# EasyEDA Pro project 实战项目.eprj, board PCB1
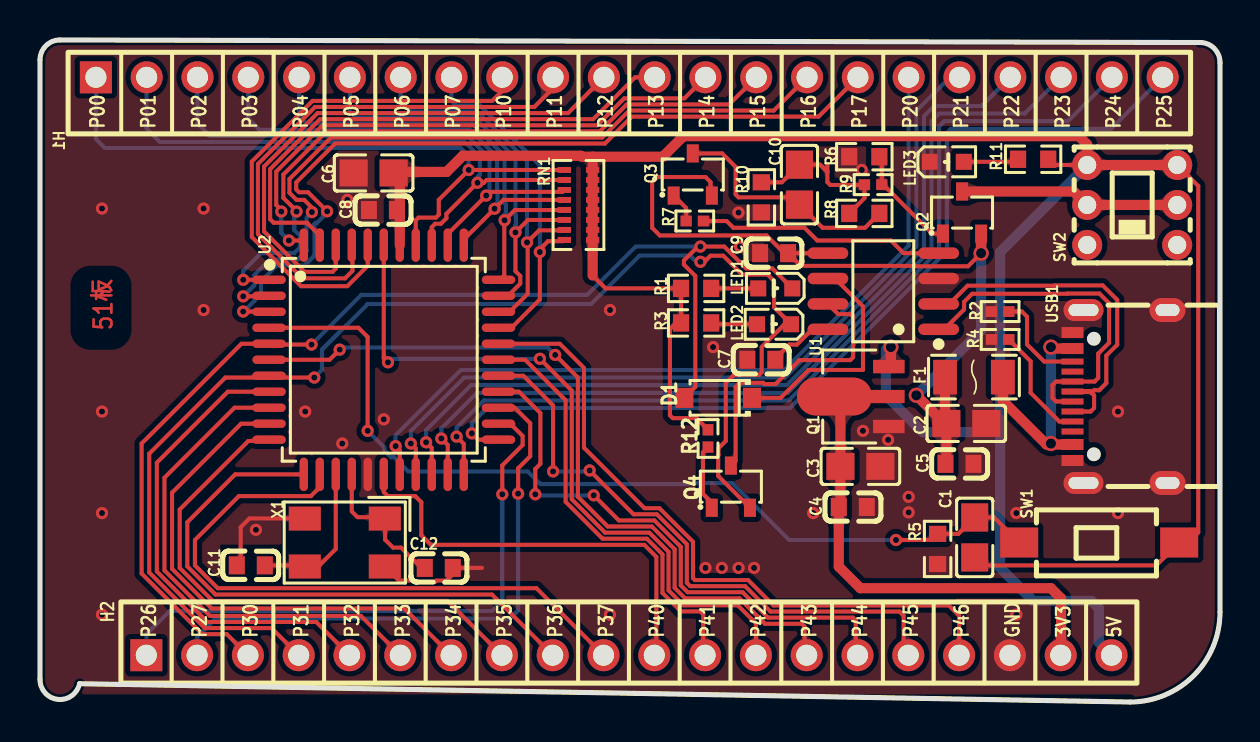
[diagram p1: board, top side]
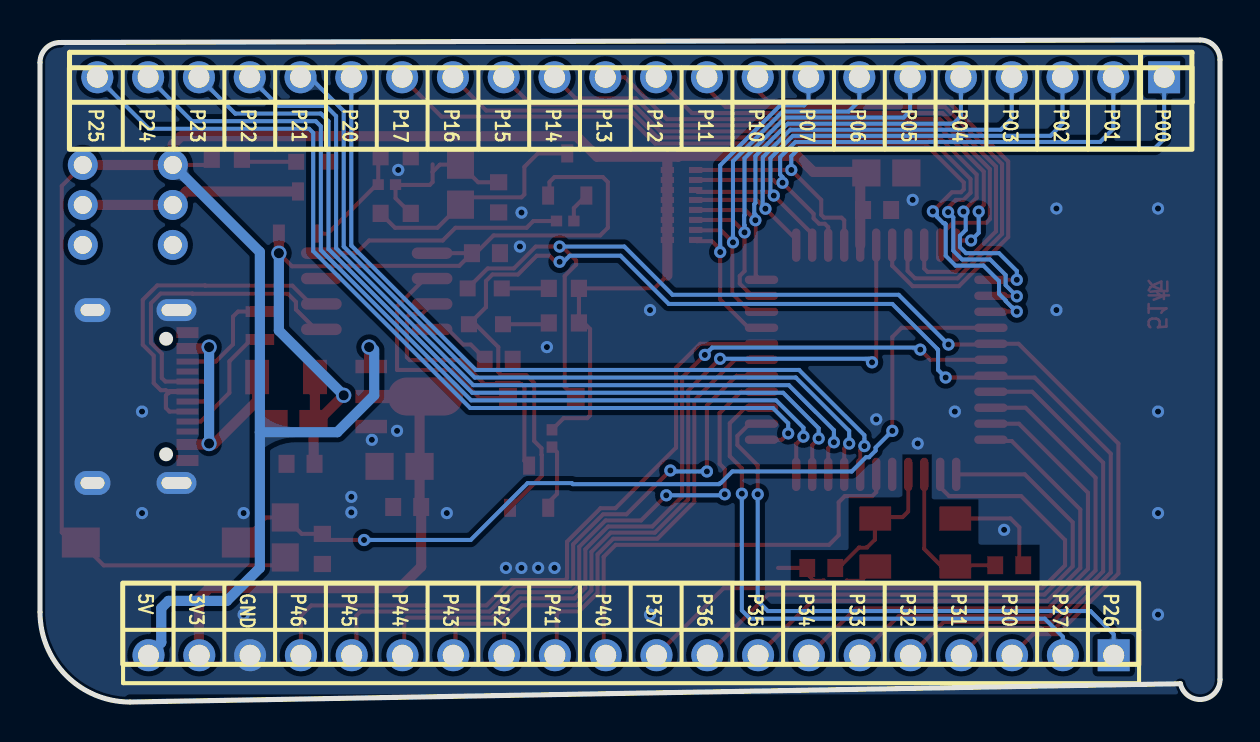
[diagram p2: board, bottom side, seen from below]

Outline 59 x 33.13 mm; copper layers: Top Layer, Bottom Layer. Coordinates in mm from the lower left corner of the outline.
Outline path: 0,32.13 0,1.13 arc(0.89,0.13) 1.98,0.92 54.5,0 arc(57.68,1.32) 59,4.5 59,32 arc(58.71,32.71) 58,33 1,33.13 arc(0.29,32.83) 0,32.13
Stack: Top Layer 0.035mm / Dielectric1 1.51mm FR4 er 4.5 / Bottom Layer 0.035mm

## Design rules (mm)
net USB_D+: DP1
net USB_D-: DP1
template: 自定义配置
spacing copperThickness1oz (default): track to track 0.102, other pairs 0.152 to 0.3
spacing copperThickness2oz: track to track 0.203, other pairs 0.152 to 0.3
track width copperThickness1oz (default): min 0.127, default 0.254, max 2.54
track width copperThickness2oz: min 0.203, default 0.254, max 2.54
differential pair differentialPair (default): width min 0.127, default 0.254, max 2.54; gap min 0.152, default 0.152
via viaSize (default): diameter min 0.5, default 0.61, max 10; hole min 0.3, default 0.305, max 6.3

## Placement (name value [footprint] x y rotation side)
C1  10uF  [C0805]  46.74 8.23 270 top
C2  10uF  [C0805]  46.32 13.94 180 top
C3  10uF  [C0805]  41.02 11.79 180 top
C4  100nF  [C0603]  40.64 9.76 180 top
C5  100nF  [C0603]  45.97 11.92 180 top
C6  10uF  [C0805]  16.68 26.47 180 top
C7  100nF  [C0603]  36.07 17.12 0 top
C8  100nF  [C0603]  17.15 24.62 180 top
C9  100nF  [C0603]  36.7 22.46 0 top
C10  22uF  [C0805]  37.97 25.89 90 top
C11  20pF  [C0603]  10.54 6.84 0 top
C12  20pF  [C0603]  19.94 6.71 180 top
D1  B0520W  [SOD-123_L2.6-W1.7-LS3.5-RD]  33.91 15.22 180 top
F1  JK-nSMD050-30  [F1206]  46.7 16.26 180 top
H1  X6511WV-22H-C60D30  [HDR-TH_22P-P2.54-V-M]  29.46 31.26 0 bottom
H2  X6511WV-20H-C60D30  [HDR-TH_20P-P2.54-V-M]  29.45 2.34 0 bottom
LED1  SZYY0603R  [LED0603-R-RD]  36.76 20.7 180 top
LED2  SZYY0603R  [LED0603-R-RD]  36.7 18.9 180 top
LED3  SZYY0603R  [LED0603-R-RD]  45.34 27.03 0 top
Q1  AMS1117-3.3V  [SOT-89-3_L4.5-W2.5-P1.50-LS4.2-BR]  41.08 15.29 0 top
Q2  AO3401  [SOT-23-3_L2.9-W1.4-P1.90-LS2.6-BR]  46.1 24.49 270 top
Q3  AO3401  [SOT-23-3_L2.9-W1.4-P1.90-LS2.6-BR]  32.64 26.4 270 top
Q4  2SK3018  [SOT-23-3_L2.9-W1.4-P1.90-LS2.6-BR]  34.54 10.77 270 top
R1  1kΩ  [R0603]  32.81 20.7 180 top
R2  5.1kΩ  [R0402]  48.01 19.54 180 top
R3  1kΩ  [R0603]  32.81 18.97 180 top
R4  5.1kΩ  [R0402]  48.01 18.14 180 top
R5  10kΩ  [R0603]  44.88 7.66 90 top
R6  10kΩ  [R0603]  41.22 27.28 0 top
R7  10Ω  [R0402]  32.74 24.07 180 top
R8  47kΩ  [R0603]  41.22 24.45 0 top
R9  10Ω  [R0402]  41.66 25.89 180 top
R10  10kΩ  [R0603]  36.07 25.25 90 top
R11  1kΩ  [R0603]  49.66 27.16 0 top
R12  10Ω  [R0402]  33.4 13.19 90 top
RN1  10kΩ  [RES-ARRAY-SMD_0402-16P-L4.0-W1.6-BL]  26.92 24.87 270 top
SW1  TS-1101-C-W  [SW-SMD_L6.0-W3.3-LS8.0]  52.96 7.98 0 top
SW2  PS-5850A-6PL  [SW-TH_6P-L5.8-W5.8-P2.00-LS4.5-BL_1]  54.61 24.87 90 top
U1  CH340N  [SOP-8_L5.0-W4.0-P1.27-LS6.0-BL]  42.16 20.55 90 top
U2  STC89C52RC-40I-LQFP44  [LQFP-44_L10.0-W10.0-P0.80-LS12.0-BL]  17.19 17.13 270 top
USB1  TYPE-C 16PIN 2MD(073)  [USB-C-SMD_TYPE-C-6PIN-2MD-073]  54 15.29 90 top
X1  11.0592MHz  [CRYSTAL-SMD_4P-L5.0-W3.2-BL]  15.24 7.98 180 top

## Footprints (pads in the part's own frame, mm; a bottom-side part is the same pattern mirrored in y, then rotated)
C0603
  rect 0.8x0.9 smd: 1(-0.7,0) 2(0.7,0)
C0805
  rect 1.41x1.35 smd: 1(-1,0) 2(1,0)
CRYSTAL-SMD_4P-L5.0-W3.2-BL
  rect 1.6x1.2 smd: 1(-2,-1.2) 2(2,-1.2) 3(2,1.2) 4(-2,1.2)
F1206
  rect 1.19x1.728 smd: 1(-1.445,0) 2(1.445,0)
HDR-TH_20P-P2.54-V-M
  rect 1.6x1.6 hole 1.05: 1(-24.13,0)
  round 1.6 hole 1.05: 2(-21.59,0) 3(-19.05,0) 4(-16.51,0) 5(-13.97,0) 6(-11.43,0) 7(-8.89,0) 8(-6.35,0) 9(-3.81,0) 10(-1.27,0) 11(1.27,0) 12(3.81,0) 13(6.35,0) 14(8.89,0) 15(11.43,0) 16(13.97,0) 17(16.51,0) 18(19.05,0) 19(21.59,0) 20(24.13,0)
HDR-TH_22P-P2.54-V-M
  rect 1.6x1.6 hole 1.05: 1(-26.67,0)
  round 1.6 hole 1.05: 2(-24.13,0) 3(-21.59,0) 4(-19.05,0) 5(-16.51,0) 6(-13.97,0) 7(-11.43,0) 8(-8.89,0) 9(-6.35,0) 10(-3.81,0) 11(-1.27,0) 12(1.27,0) 13(3.81,0) 14(6.35,0) 15(8.89,0) 16(11.43,0) 17(13.97,0) 18(16.51,0) 19(19.05,0) 20(21.59,0) 21(24.13,0) 22(26.67,0)
LED0603-R-RD
  rect 0.8x0.8 smd: 1(0.851,0) 2(-0.851,0)
LQFP-44_L10.0-W10.0-P0.80-LS12.0-BL
  oval 0.42x1.67 smd: 1(-4,-5.735) 2(-3.2,-5.735) 3(-2.4,-5.735) 4(-1.6,-5.735) 5(-0.8,-5.735) 6(0,-5.735) 7(0.8,-5.735) 8(1.6,-5.735) 9(2.4,-5.735) 10(3.2,-5.735) 11(4,-5.735) 23(4,5.735) 24(3.2,5.735) 25(2.4,5.735) 26(1.6,5.735) 27(0.8,5.735) 28(0,5.735) 29(-0.8,5.735) 30(-1.6,5.735) 31(-2.4,5.735) 32(-3.2,5.735) 33(-4,5.735)
  oval 1.67x0.42 smd: 12(5.735,-4) 13(5.735,-3.2) 14(5.735,-2.4) 15(5.735,-1.6) 16(5.735,-0.8) 17(5.735,0) 18(5.735,0.8) 19(5.735,1.6) 20(5.735,2.4) 21(5.735,3.2) 22(5.735,4) 34(-5.735,4) 35(-5.735,3.2) 36(-5.735,2.4) 37(-5.735,1.6) 38(-5.735,0.8) 39(-5.735,0) 40(-5.735,-0.8) 41(-5.735,-1.6) 42(-5.735,-2.4) 43(-5.735,-3.2) 44(-5.735,-4)
R0402
  rect 0.566x0.54 smd: 1(-0.433,0) 2(0.433,0)
R0603
  rect 0.806x0.864 smd: 1(-0.753,0) 2(0.753,0)
RES-ARRAY-SMD_0402-16P-L4.0-W1.6-BL
  rect 0.3x0.665 smd: 1(-1.75,-0.708) 2(-1.25,-0.708) 3(-0.75,-0.708) 4(-0.25,-0.708) 5(0.25,-0.708) 6(0.75,-0.708) 7(1.25,-0.708) 8(1.75,-0.708) 9(1.75,0.708) 10(1.25,0.708) 11(0.75,0.708) 12(0.25,0.708) 13(-0.25,0.708) 14(-0.75,0.708) 15(-1.25,0.708) 16(-1.75,0.708)
SOD-123_L2.6-W1.7-LS3.5-RD
  rect 0.9x1 smd: 1(-1.692,0) 2(1.692,0)
SOP-8_L5.0-W4.0-P1.27-LS6.0-BL
  oval 0.574x2.035 smd: 1(-1.905,-2.768) 2(-0.635,-2.768) 3(0.635,-2.768) 4(1.905,-2.768) 5(1.905,2.768) 6(0.635,2.768) 7(-0.635,2.768) 8(-1.905,2.768)
SOT-23-3_L2.9-W1.4-P1.90-LS2.6-BR
  rect 0.91x0.6 smd: 1(1.055,-0.955) 2(1.055,0.955) 3(-1.055,0)
SOT-89-3_L4.5-W2.5-P1.50-LS4.2-BR
  rect 1.575x0.672 smd: 1(1.356,-1.5) 3(1.356,1.5)
  custom 5.377x1.9 smd: 2(-1.356,0)
SW-SMD_L6.0-W3.3-LS8.0
  rect 1.9x1.5 smd: 1(-4,0) 2(4,0)
SW-TH_6P-L5.8-W5.8-P2.00-LS4.5-BL_1
  round 1.5 hole 0.9: 1(-2,-2.25) 2(0,-2.25) 3(2,-2.25) 4(-2,2.25) 5(0,2.25) 6(2,2.25)
USB-C-SMD_TYPE-C-6PIN-2MD-073
  rect 0.55x1.1 smd: 1(-3.2,2.375) 2(-2.4,2.375) 11(2.4,2.375) 12(3.2,2.375)
  rect 0.3x1.1 smd: 3(-1.75,2.375) 4(-1.25,2.375) 5(-0.75,2.375) 6(-0.25,2.375) 7(0.25,2.375) 8(0.75,2.375) 9(1.25,2.375) 10(1.75,2.375)
  oval 1.1x2 hole 0.6x1.5: 13(-4.325,1.825) 14(4.325,1.825)
  oval 1.2x1.8 hole 0.6x1.2: 13(-4.325,-2.375) 14(4.325,-2.375)

## Nets
As in the schematic.

Pads without a net: SW2 1 4; USB1 3 9

## Via types
v1: diameter 0.762, hole 0.508, Top Layer to Bottom Layer, 5 vias
v2: diameter 0.61, hole 0.305, Top Layer to Bottom Layer, 68 vias

## Routing (per net, layer and track width the routed paths; a pad name or vN(x,y) marks a point on that pad's centre or on a via; arc(x,y) is an arc through that point)
3V3: length 23.4
  Top Layer w0.508: Q1.2 40.02,14.99 C3.2 40.02,9.84 C4.2 39.94,6.78 41.02,5.69 50.55,5.69 51.05,5.19 51.05,2.23 51.04,2.21
GND: length 11
  Top Layer w0.203: C11.1 10.03,7.03 10.03,8.74 10.48,9.19 13.23,9.19 X1.2 ; X1.4 17.94,6.08 18.67,6.08 18.73,6.01 19.74,6.01 19.81,6.08 20.32,6.08 20.64,6.39 20.64,6.71 22.1,6.71
  vias: v2(3.1,24.69) v2(3.1,14.53) v2(3.1,9.45) v2(3.1,4.37) v2(8.18,24.69) v2(8.18,19.61) v2(10.79,8.62) v2(13.26,14.53) v2(15.11,12.93) v2(15.37,25.13) v2(17.19,14.14) v2(28.5,19.61) v2(28.5,4.37) v2(33.27,6.71) v2(33.66,17.76) v2(34.09,6.71) v2(34.93,24.49) v2(34.93,6.71) v2(35,22.79) v2(35.7,6.71) v2(38.66,9.45) v2(41.09,26.62) v2(41.15,13.57) v2(42.41,13.12) v2(43.43,10.27) v2(43.43,9.49) v2(48.82,9.45) v2(48.82,4.37) v2(53.9,14.53) v2(53.9,9.45)
VCC: length 137.1
  Top Layer w0.203: 27.63,21.34 28.28,20.7 R1.2 R3.2 31.8,18.97 31.5,18.67 31.5,14.35 31.64,14.2 32.82,14.2 R12.2 ; SW2.6 50.7,26.87 R11.2 ; C1.2 47.13,6.84 55.82,6.84 SW1.2 57.4,7.98 57.91,8.49 57.91,25.82 SW2.3
  Top Layer w0.508: 27.63,27.28 31.14,27.28 32.17,28.31 51.94,28.31 52.36,27.89 SW2.6 SW2.3 ; 27.63,27.28 RN1.16 RN1.15 RN1.14 RN1.13 RN1.12 RN1.11 RN1.10 RN1.9 27.63,21.34 ; 27.63,27.28 27.09,27.28 27.05,27.33 21.14,27.33 20.33,26.52 17.99,26.52 U2.38 ; Q1.3 42.54,16.89 v1(42.54,17.76)
  Bottom Layer w0.508: 48.01,13.5 44.14,13.5 42.29,15.35 42.29,17.63 ; 48.01,13.5 48.01,22.52 SW2.6 ; 48.01,13.5 48.01,6.71 49.66,5.06 52.58,5.06 52.94,4.7 52.94,2.98 H2.20
VCC_SW: length 11
  Top Layer w0.508: SW2.2 SW2.5 51.69,25.55 Q2.3
VIN_5V: length 41.4
  Top Layer w0.203: C9.2 38.04,21.82 43.73,21.82 43.75,21.8 46.4,21.8 v1(47.06,22.46) ; C9.2 U1.5 ; C9.2 37.21,22.46 36.32,23.35 30.99,23.35 30.61,23.73 30.61,26.02 30.86,26.27 33.27,26.27 33.53,26.02 33.53,25.41 Q3.2
  Top Layer w0.508: v1(43.81,15.35) 45.22,13.94 C2.2 45.32,11.96 ; Q2.2 v1(47.06,22.46) ; F1.2 45.25,14.01
  Bottom Layer w0.508: v1(43.81,15.35) 47.06,18.59 v1(47.06,22.46)
P00: length 32.9
  Top Layer w0.203: RN1.1 v2(21.44,26.62) 19.94,25.13 19.94,24.38 19.8,24.24 18.92,24.24 18.79,24.1 U2.37
  Bottom Layer w0.203: v2(21.44,26.62) 21.44,27.31 21.03,27.72 3.25,27.72 2.79,28.17 H1.1
P01: length 29.8
  Top Layer w0.203: RN1.2 22.33,26.12 22.19,25.98 v2(21.87,25.98) 20.32,24.43 20.32,24.2 20.05,23.93 19.76,23.93 19.59,23.76 U2.36
  Bottom Layer w0.203: H1.2 5.33,28.68 5.99,28.02 21.23,28.02 21.99,27.26 21.99,26.39 21.87,26.27 v2(21.87,25.98)
P02: length 26.9
  Top Layer w0.203: RN1.3 26.12,25.53 22.49,25.53 v2(22.31,25.34) 20.39,23.42 U2.35
  Bottom Layer w0.203: v2(22.31,25.34) 22.48,25.51 22.48,27.21 21.36,28.33 8.48,28.33 7.87,28.94 H1.3
P03: length 24.1
  Top Layer w0.203: RN1.4 26.21,25.13 23.17,25.13 v2(22.73,24.68) 21.19,23.14 U2.34
  Bottom Layer w0.203: H1.4 10.41,29.19 10.97,28.64 21.48,28.64 22.86,27.26 22.86,25.58 22.87,25.57 22.87,24.82 v2(22.73,24.68)
P04: length 22.6
  Top Layer w0.203: 22.99,21.13 23.21,21.35 23.21,24.09 v2(23.23,24.11) 23.74,24.62 26.21,24.62 RN1.5
  Bottom Layer w0.203: v2(23.23,24.11) 23.23,24.39 23.29,24.45 23.29,24.91 23.23,24.97 23.23,27.32 21.61,28.94 13.33,28.94 12.95,29.32 H1.5
P05: length 21.4
  Top Layer w0.203: RN1.6 24.4,24.12 v2(23.77,23.5) 23.77,21.56 24.01,21.32 24.01,20.93 23.4,20.33 U2.32
  Bottom Layer w0.203: H1.6 15.49,29.57 15.82,29.25 21.74,29.25 23.77,27.21 23.77,24.36 23.79,24.34 23.79,23.88 23.77,23.86 v2(23.77,23.5)
P06: length 19.4
  Top Layer w0.203: U2.31 23.48,19.53 24.38,20.43 24.38,22.97 v2(24.35,23) 24.95,23.6 26.2,23.6 RN1.7
  Bottom Layer w0.203: v2(24.35,23) 24.35,27.06 21.86,29.55 18.56,29.55 18.03,30.08 H1.7
P07: length 17.9
  Top Layer w0.203: U2.30 23.57,18.73 24.99,20.14 v2(24.99,22.52) 24.99,22.65 25.4,23.06 26.15,23.06 RN1.8
  Bottom Layer w0.203: v2(24.99,22.52) 24.99,26.86 21.99,29.86 20.8,29.86 20.57,30.08 H1.8
P10: length 26.7
  Top Layer w0.203: H1.9 23.11,30.59 22.61,30.08 13.62,30.08 10.59,27.05 10.59,23.27 13.05,20.81 15.37,20.81 16.39,21.83 U2.40
P11: length 27.5
  Top Layer w0.203: U2.41 15.62,22.83 15.62,21.57 15.25,21.2 13.12,21.2 10.9,23.42 10.9,26.92 13.75,29.77 24.71,29.77 25.65,30.71 H1.10
P12: length 27.8
  Top Layer w0.203: H1.11 26.4,29.47 13.88,29.47 11.2,26.79 11.2,23.55 13.23,21.52 14.62,21.52 14.79,21.69 U2.42
P13: length 26.9
  Top Layer w0.203: H1.12 29.76,31.26 27.66,29.16 14,29.16 11.51,26.67 11.51,24.16 11.68,23.98 13.34,23.98 13.37,23.95 13.38,23.95 13.99,23.34 U2.43
P14: length 27.7
  Top Layer w0.203: U2.44 12.96,23.09 12.7,23.09 ; H1.13 32.22,30.21 29.21,30.21 27.86,28.86 14.13,28.86 11.81,26.54 11.81,24.87 12.06,24.62 v2(12.06,24.54)
  Bottom Layer w0.203: v2(12.45,23.09) 12.06,23.48 v2(12.06,24.54)
P15: length 34.8
  Top Layer w0.203: v2(12.83,24.54) 12.83,24.57 12.17,25.23 12.17,26.39 14.33,28.55 27.99,28.55 29.34,29.9 34.46,29.9 H1.14 ; U2.1 v2(10.16,21.13)
  Bottom Layer w0.203: v2(10.16,21.13) 10.16,21.57 11.05,22.46 12.7,22.46 13,22.76 13,23.33 12.71,23.62 12.71,24.43 v2(12.83,24.54)
P16: length 38.1
  Top Layer w0.203: v2(13.59,24.51) 13.59,24.74 13.21,25.13 12.83,25.13 12.47,25.48 12.47,26.17 14.55,28.25 28.12,28.25 29.46,29.6 36.69,29.6 H1.15 ; U2.2 11.43,20.3 v2(10.16,20.3)
  Bottom Layer w0.203: v2(13.59,24.51) 13.34,24.25 13.34,22.59 12.89,22.14 11.49,22.14 10.72,21.37 10.72,20.86 v2(10.16,20.3)
P17: length 41.3
  Top Layer w0.203: v2(14.36,24.55) 13.4,25.51 12.95,25.51 12.81,25.65 12.81,26 14.75,27.94 28.24,27.94 29.59,29.29 38.93,29.29 H1.16 ; U2.3 11.44,19.54 10.41,19.54
  Bottom Layer w0.203: v2(14.36,24.55) 14.15,24.35 14.15,24.28 13.83,23.95 13.76,23.95 13.72,23.91 13.72,22.33 13.22,21.84 11.82,21.84 11.05,21.06 11.05,20.43 10.72,20.1 10.72,20.07 10.39,19.74 10.36,19.74 v2(10.16,19.54)
P20: length 40
  Top Layer w0.203: U2.18 17.99,12.6 v2(17.78,12.81)
  Bottom Layer w0.203: H1.17 43.43,22.84 37.21,16.62 21.05,16.62 17.78,13.35 v2(17.78,12.81)
P21: length 41
  Top Layer w0.203: v2(18.54,12.93) 18.79,12.69 U2.19
  Bottom Layer w0.203: v2(18.54,12.93) 18.54,13.57 21.21,16.24 37.26,16.24 43.81,22.79 43.81,29.57 45.5,31.26 H1.18
P22: length 42.7
  Top Layer w0.203: U2.20 19.59,12.71 v2(19.3,13)
  Bottom Layer w0.203: H1.19 47.08,29.82 44.7,29.82 44.2,29.32 44.2,22.71 37.34,15.85 21.56,15.85 19.3,13.6 v2(19.3,13)
P23: length 44.5
  Top Layer w0.203: v2(20.07,13.19) 20.39,12.87 U2.21
  Bottom Layer w0.203: v2(20.07,13.19) 20.07,13.7 21.84,15.47 37.39,15.47 44.58,22.66 44.58,29.06 44.96,29.44 49.24,29.44 H1.20
P24: length 46.1
  Top Layer w0.203: v2(20.83,13.28) 21.19,12.92 U2.22
  Bottom Layer w0.203: v2(20.83,13.28) 20.83,13.73 22.19,15.09 37.44,15.09 44.96,22.61 44.96,28.81 45.21,29.06 51.4,29.06 H1.21
P25: length 47.2
  Top Layer w0.203: U2.23 21.91,13.13 v2(21.59,13.44)
  Bottom Layer w0.203: v2(21.59,13.44) 21.59,13.95 22.35,14.71 37.49,14.71 45.34,22.56 45.34,28.48 45.54,28.68 53.56,28.68 H1.22
P26: length 29.7
  Top Layer w0.203: v2(23.11,10.39) 23.11,11.84 24.13,12.86 24.13,13.31 23.52,13.93 U2.24
  Bottom Layer w0.203: v2(23.11,10.39) 23.11,5.06 22.61,4.55 6.48,4.55 5.32,3.39 H2.1
P27: length 29
  Top Layer w0.203: v2(23.91,10.42) 23.91,11.69 24.51,12.3 24.51,13.95 23.73,14.73 U2.25
  Bottom Layer w0.203: H2.2 7.86,3.26 8.76,4.17 23.5,4.17 23.91,4.58 v2(23.91,10.42)
P30: length 59.5
  Top Layer w0.203: LED1.2 36.62,21.7 35.31,21.7 34.21,22.79 v2(33.02,22.79) 32.89,22.79 32.19,22.09 32.19,21.89 32.77,21.32 32.77,15.77 D1.2 ; v2(13.58,17.89) 11.49,17.89 U2.5 10.07,17.93 5.08,12.93 5.08,6.43 8.12,3.39 9.34,3.39 H2.3
  Bottom Layer w0.203: v2(13.58,17.89) 16.07,20.38 27.37,20.38 29.78,22.79 v2(33.02,22.79)
P31: length 66.7
  Top Layer w0.203: Q4.2 33.91,11.31 33.91,12.35 33.92,12.37 33.92,12.7 34.29,13.06 34.29,15.97 34.69,16.36 35.94,16.36 36.08,16.51 36.08,17.76 37.23,18.9 LED2.2 36.7,19.75 36.7,21.07 36.38,21.39 35.1,21.39 34.16,22.33 33.53,22.33 33.22,22.03 v2(33.02,22.03) ; H2.4 11.58,3.7 8.24,3.7 5.46,6.48 5.46,12.43 9.27,16.24 11.36,16.24 U2.7 11.54,16.24 v2(13.72,16.24)
  Bottom Layer w0.203: v2(33.02,22.03) 32.82,22.03 32.51,22.33 29.97,22.33 27.56,19.92 16.38,19.92 14.14,17.67 14.14,17.66 14.1,17.62 14.1,16.62 v2(13.72,16.24)
P32: length 23.9
  Top Layer w0.203: U2.8 9.39,15.53 5.84,11.98 5.84,6.53 8.37,4.01 13.81,4.01 H2.5
P33: length 24.9
  Top Layer w0.203: H2.6 16.05,4.31 8.5,4.31 6.22,6.58 6.22,11.22 9.72,14.73 U2.9
P34: length 25.8
  Top Layer w0.203: U2.10 10.06,13.93 6.6,10.47 6.6,6.66 8.59,4.68 18.22,4.68 H2.7
P35: length 26.8
  Top Layer w0.203: H2.8 20.38,5.06 8.64,5.06 6.98,6.71 6.98,9.63 10.41,13.06 11.39,13.06 U2.11
P36: length 29.1
  Top Layer w0.203: H2.9 22.6,5.38 8.78,5.38 7.37,6.79 7.37,9 9.76,11.39 U2.12
P37: length 31.5
  Top Layer w0.203: H2.10 24.82,5.69 8.89,5.69 7.75,6.84 7.75,8.11 9.94,10.3 13.54,10.3 13.99,10.75 U2.13
P40: length 21.8
  Top Layer w0.203: U2.17 17.19,10.51 17.39,10.3 18.76,10.3 19.07,10 19.07,8.35 19.55,7.87 30.21,7.87 30.82,7.26 30.82,2.44 H2.11
P41: length 21.7
  Top Layer w0.203: H2.12 33.16,2.43 33.16,4.39 33.02,4.54 32.05,4.54 31.12,5.46 31.12,7.39 30.34,8.17 28.13,8.17 26.28,10.02 26.28,15.1 24.26,17.13 U2.28
P42: length 35.8
  Top Layer w0.203: U2.39 17.19,17.21 v2(17.4,17) ; v2(25,17.18) 26.59,15.58 26.59,10.15 28.26,8.48 30.47,8.48 31.43,7.52 31.43,5.59 32.17,4.84 34.89,4.84 35.8,3.94 H2.13
  Bottom Layer w0.203: v2(25,17.18) 17.58,17.18 v2(17.4,17)
P43: length 38.9
  Top Layer w0.203: U2.6 14.48,17.13 v2(14.99,17.63) ; v2(25.76,17.37) 26.89,16.23 26.89,10.27 28.38,8.78 30.59,8.78 31.73,7.64 31.73,5.71 32.26,5.19 34.98,5.19 36.25,3.92 38.08,3.92 38.23,3.77 38.23,2.45 H2.14
  Bottom Layer w0.203: v2(25.76,17.37) 25.39,17.73 15.09,17.73 v2(14.99,17.63)
P44: length 28.2
  Top Layer w0.203: v2(27.69,10.34) 28.94,9.09 30.72,9.09 32.04,7.77 32.04,5.84 32.38,5.49 35.13,5.49 36.4,4.22 40.64,4.22 40.78,4.08 40.78,2.43 H2.15 ; v2(24.76,10.39) 24.76,11.66 25.02,11.92 25.02,14.46 23.95,15.53 U2.26
  Bottom Layer w0.203: v2(27.69,10.34) 24.82,10.34 v2(24.76,10.39)
P45: length 30.4
  Top Layer w0.203: H2.16 43.18,2.58 43.18,4.32 42.98,4.53 36.52,4.53 35.25,5.8 32.51,5.8 32.34,5.96 32.34,7.89 30.85,9.39 29.68,9.39 v2(27.48,11.59) ; v2(25.65,11.54) 25.65,14.84 24.17,16.33 U2.27
  Bottom Layer w0.203: v2(25.65,11.54) 27.43,11.54 v2(27.48,11.59)
P46: length 34
  Top Layer w0.203: H2.17 45.96,4.32 45.44,4.83 36.68,4.83 35.41,6.1 32.75,6.1 32.65,6.2 32.65,8.02 30.97,9.7 30.23,9.7 27.2,12.72 27.2,16.72 25.99,17.93 U2.29
RST: length 45.8
  Top Layer w0.203: U2.4 15.92,18.73 16.38,18.27 v2(16.38,13.57) ; v2(42.8,8.11) 44.57,8.11 R5.2 45.91,8.41 C1.1 47.71,9.23 SW1.1
  Bottom Layer w0.203: v2(16.38,13.57) 17.22,12.73 17.22,12.58 17.55,12.25 17.7,12.25 18.41,11.54 24.38,11.54 24.97,10.95 25,10.95 25.05,10.9 32.36,10.9 32.41,10.95 34.62,10.95 37.47,8.11 v2(42.8,8.11)
RTS: length 12.4
  Top Layer w0.203: U1.4 43.18,22.46 42.54,23.09 38.86,23.09 38.23,23.73 34.67,23.73 34.33,24.07 R7.1
USB_D+: length 17.8
  Top Layer w0.203: USB1.6 51.62,15.04 50.8,15.04 50.62,15.22 50.62,15.86 50.8,16.04 USB1.8 52.73,16.04 52.91,16.22 52.91,17.43 53.45,17.97 53.45,19.95 52.97,20.44 51.38,20.44 51.37,20.43 46.61,20.43 46.2,20.02 46.2,19.64 45.21,18.65 U1.1
USB_D-: length 17.9
  Top Layer w0.203: USB1.5 51.63,14.53 52.53,14.53 52.71,14.71 52.71,15.35 52.58,15.47 52.71,15.6 52.96,15.6 53.32,15.96 53.32,17.33 53.86,17.88 53.86,20.12 53.14,20.85 50.75,20.85 50.73,20.83 46.38,20.83 45.47,19.92 U1.2
  Top Layer w0.254: USB1.7 52.52,15.54 52.58,15.47
XTAL1: length 7.3
  Top Layer w0.203: C12.2 19.07,6.71 18.05,7.73 17.65,7.73 17.26,8.12 17.26,9.17 X1.1 17.17,9.25 15.88,9.25 15.59,9.54 U2.15
XTAL2: length 7.7
  Top Layer w0.203: C11.2 13.18,6.84 X1.3 13.91,6.78 14.79,7.66 U2.14
$1N354: length 5
  Top Layer w0.203: USB1.10 50.21,17.04 49.35,17.89 49.35,19.28 49.1,19.54 R2.1
$1N433: length 5.9
  Top Layer w0.203: R4.1 49.53,17.05 49.53,15.47 50.97,14.04 USB1.4
  Top Layer w0.254: 48.44,18.09 R4.1
$1N470: length 11.5
  Top Layer w0.508: F1.1 48.14,15.07 50.33,12.89 USB1.2 ; USB1.11 50.62,17.69 v1(50.55,17.76)
  Bottom Layer w0.508: v1(50.55,17.76) v1(50.55,12.93)
$1N3518: length 2.8
  Top Layer w0.203: LED3.1 48.78,27.03 R11.1
$1N3810: length 11.6
  Top Layer w0.203: U1.6 39.75,21.19 41.15,19.79 41.15,16.62 38.43,16.62 37.03,15.22 D1.1
$1N3814: length 14.1
  Top Layer w0.203: Q4.3 34.78,12.07 34.78,15.77 34.93,15.91 34.98,15.91 35.05,15.97 36.16,15.97 36.22,15.91 36.78,15.91 37.97,17.11 40.51,17.11 40.66,17.25 40.66,18.41 40.67,18.42 40.67,18.87 40.66,18.88 40.66,19.27 40.51,19.41 39.9,19.41 U1.7
$1N3822: length 3.3
  Top Layer w0.203: U1.8 38.61,18.65 37.85,17.89 37.47,17.89 36.7,17.12
$1N4053: length 2.4
  Top Layer w0.203: 35.91,20.7 R1.1
$1N4133: length 2.3
  Top Layer w0.203: LED2.1 33.63,18.9 R3.1
$1N4735: length 12
  Top Layer w0.203: R8.2 41.25,23.73 39.13,23.73 C10.1 37.61,25.25 34.93,25.25 34.78,25.4 34.78,26.78 34.11,27.45 Q3.3
$1N4750: length 8.4
  Top Layer w0.203: 39.37,26.52 39.37,26.02 39.51,25.87 41.21,25.87 R9.2 41.22,25.21 R8.1 ; 39.37,26.52 39.37,26.9 ; 39.37,26.52 39,26.89 C10.2 37.09,26.01 R10.2
$1N4828: length 1.5
  Top Layer w0.203: Q3.1 32.31,24.72 R7.2
$1N5081: length 5.5
  Top Layer w0.203: Q2.1 44.62,23.44 42.16,25.89 R9.1 42.09,27.16 R6.2
$1N9141: length 2.9
  Top Layer w0.203: 33.46,10.1 33.15,10.42 33.15,12.5 R12.1

## Copper pours and planes (outline as drawn; the poured copper is in the pictures)
GND on Top Layer: -0.76,34.4 60.58,34.4 60.58,-0.4 -0.76,-0.4
GND on Bottom Layer: -1.14,34.27 59.82,34.27 59.82,-0.91 -1.14,-0.91

Small or netless copper shapes (teardrops, artwork), in the pictures only: 204 on Top Layer, 43 on Bottom Layer

## Text on the board
Bottom Silkscreen Layer: P00 | P01 | P26 | P02 | P27 | P03 | P30 | P04 | P31 | P05 | P32 | P06 | P33 | P07 | P34 | P10 | P35 | P11 | P36 | P12 | P37 | P13 | P40 | P14 | P41 | P15 | P42 | P16 | P43 | P17 | P44 | P20 | P45 | P21 | P46 | P22 | GND | P23 | 3V3 | P24 | 5V | P25
Top Layer: 51板
Top Solder Mask Layer: 51板
Top Silkscreen Layer: H2 | P00 | P01 | P26 | P02 | P27 | P03 | P30 | P04 | P31 | P05 | P32 | P06 | P33 | P07 | P34 | P10 | P35 | P11 | P36 | P12 | P37 | P13 | P40 | P14 | P41 | P15 | P42 | P16 | P43 | P17 | P44 | P20 | P45 | P21 | P46 | P22 | GND | P23 | 3V3 | P24 | 5V | P25
